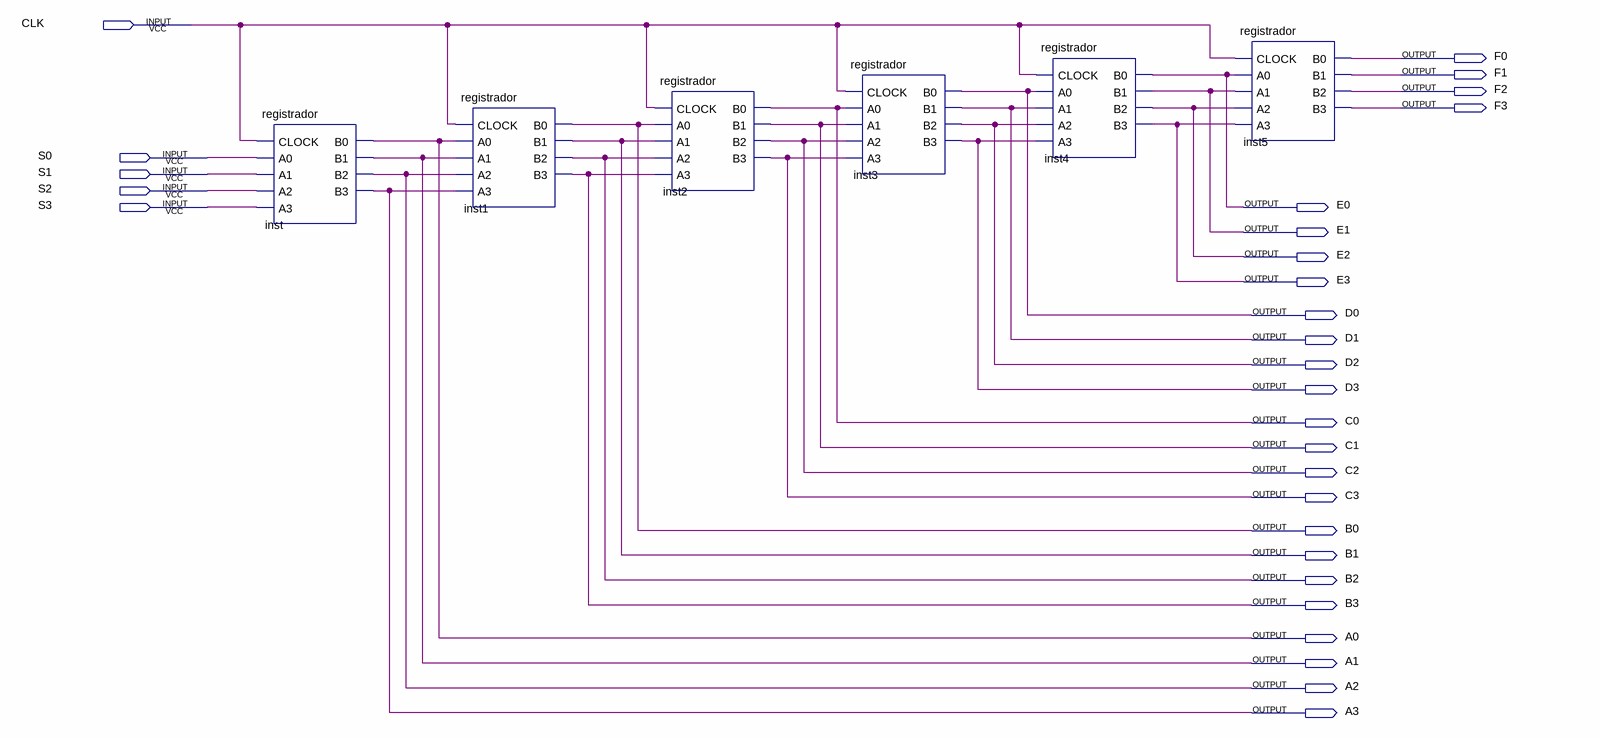
[diagram p0: schematic sheet]
// Quartus schematic registradordeslocamento.bdf as structural Verilog: 6 symbols, 29 pins
module registradordeslocamento (
  input  CLK,
  input  S0,
  input  S1,
  input  S2,
  input  S3,
  output F0,
  output F1,
  output F2,
  output F3,
  output E0,
  output E1,
  output E2,
  output E3,
  output D0,
  output D1,
  output D2,
  output D3,
  output C0,
  output C1,
  output C2,
  output C3,
  output B0,
  output B1,
  output B2,
  output B3,
  output A0,
  output A1,
  output A2,
  output A3
);

  registrador inst (.CLOCK(CLK), .A0(S0), .A1(S1), .A2(S2), .A3(S3), .B0(A0), .B1(A1), .B2(A2), .B3(A3));
  registrador inst1 (.CLOCK(CLK), .A0(A0), .A1(A1), .A2(A2), .A3(A3), .B0(B0), .B1(B1), .B2(B2), .B3(B3));
  registrador inst2 (.CLOCK(CLK), .A0(B0), .A1(B1), .A2(B2), .A3(B3), .B0(C0), .B1(C1), .B2(C2), .B3(C3));
  registrador inst3 (.CLOCK(CLK), .A0(C0), .A1(C1), .A2(C2), .A3(C3), .B0(D0), .B1(D1), .B2(D2), .B3(D3));
  registrador inst4 (.CLOCK(CLK), .A0(D0), .A1(D1), .A2(D2), .A3(D3), .B0(E0), .B1(E1), .B2(E2), .B3(E3));
  registrador inst5 (.CLOCK(CLK), .A0(E0), .A1(E1), .A2(E2), .A3(E3), .B0(F0), .B1(F1), .B2(F2), .B3(F3));
endmodule
